# EAGLE schematic untitled (EAGLE 9.1.0)
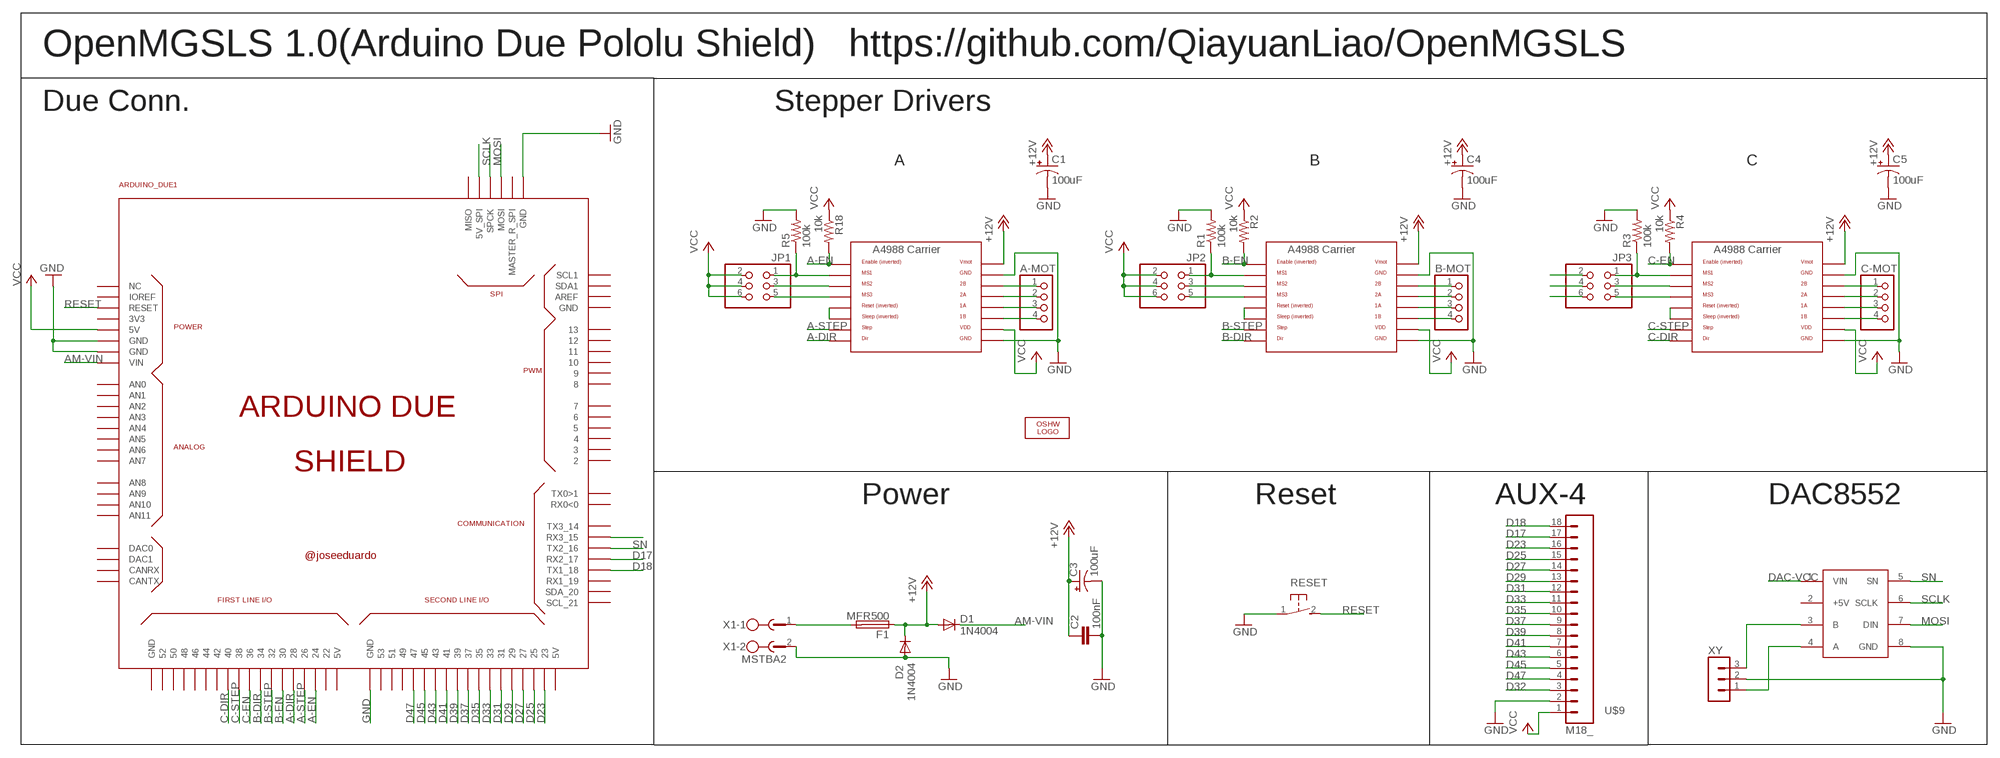
[diagram p0: schematic, sheet 1]

## Parts
A-MOT  PINHD-1X4  [1X04]
ARDUINO_DUE1  ARDUINO_DUE_SHIELD  [ARDUINO_DUE_SHIELD]
B-MOT  PINHD-1X4  [1X04]
C1  100uF  CPOL-US153CLV-0605  [153CLV-0605]
C2  100nF  C-EUC0805  [C0805]
C3  100uF  CPOL-US153CLV-0605  [153CLV-0605]
C4  100uF  CPOL-US153CLV-0605  [153CLV-0605]
C5  100uF  CPOL-US153CLV-0605  [153CLV-0605]
C-MOT  PINHD-1X4  [1X04]
D1  1N4004  [DO41-10]
D2  1N4004  [DO41-10]
F1  MFR500  PTCFUSE  [MFR500]
JP1  PINHD-2X3  [2X03]
JP2  PINHD-2X3  [2X03]
JP3  PINHD-2X3  [2X03]
LOGO1  OSHW_LOGO_6MILX0200-NT  [OSHW_6X200_NOTEXT]
R1  100k  R-US_R0805  [R0805]
R2  10k  R-US_R0805  [R0805]
R3  100k  R-US_R0805  [R0805]
R4  10k  R-US_R0805  [R0805]
R5  100k  R-US_R0805  [R0805]
R18  10k  R-US_R0805  [R0805]
RESET  31-XX  [B3F-31XX]
U$1  A4988BREAKOUT  [A4988BREAKOUT]
U$2  DAC8552  [DAC8552]
U$3  A4988BREAKOUT  [A4988BREAKOUT]
U$6  A4988BREAKOUT  [A4988BREAKOUT]
U$9  M18_  [1X18]
X1  MSTBA2  [MSTBA2]
XY  3PIN-HEADER  [3PIN-HEADER]

## Nets
+12V: C1.+ C2.1 C3.+ C4.+ C5.+ D1.A D2.C F1.1 U$1.VMOT U$3.VMOT U$6.VMOT
A-DIR: ARDUINO_DUE1.28 U$6.DIR
A-EN: ARDUINO_DUE1.24 R18.2 U$6.EN
A-STEP: ARDUINO_DUE1.26 U$6.STEP
AM-VIN: ARDUINO_DUE1.VIN D1.C
B-DIR: ARDUINO_DUE1.34 U$1.DIR
B-EN: ARDUINO_DUE1.30 R2.2 U$1.EN
B-STEP: ARDUINO_DUE1.32 U$1.STEP
C-DIR: ARDUINO_DUE1.40 U$3.DIR
C-EN: ARDUINO_DUE1.36 R4.2 U$3.EN
C-STEP: ARDUINO_DUE1.38 U$3.STEP
D17: ARDUINO_DUE1.17(RX2_17) U$9.17
D18: ARDUINO_DUE1.18(TX1_18) U$9.18
D23: ARDUINO_DUE1.23 U$9.16
D25: ARDUINO_DUE1.25 U$9.15
D27: ARDUINO_DUE1.27 U$9.14
D29: ARDUINO_DUE1.29 U$9.13
D31: ARDUINO_DUE1.31 U$9.12
D32: U$9.3
D33: ARDUINO_DUE1.33 U$9.11
D35: ARDUINO_DUE1.35 U$9.10
D37: ARDUINO_DUE1.37 U$9.9
D39: ARDUINO_DUE1.39 U$9.8
D41: ARDUINO_DUE1.41 U$9.7
D43: ARDUINO_DUE1.43 U$9.6
D45: ARDUINO_DUE1.45 U$9.5
D47: ARDUINO_DUE1.47 U$9.4
DAC-VCC: ARDUINO_DUE1.5V_2(5V_SPI) U$2.1(VIN)
GND: ARDUINO_DUE1.GND ARDUINO_DUE1.GND_1(GND) ARDUINO_DUE1.GND_3(GND) ARDUINO_DUE1.GND_5(GND) C1.- C2.2 C3.- C4.- C5.- D2.A R1.2 R3.2 R5.2 RESET.1(P) U$1.GND U$1.GND@0(GND) U$2.8(GND) U$3.GND U$3.GND@0(GND) U$6.GND U$6.GND@0(GND) U$9.2 X1.2 XY.2
MOSI: ARDUINO_DUE1.MOSI U$2.7(DIN)
N$1: U$6.RST U$6.SLP(SLEEP)
N$2: F1.2 X1.1
N$3: JP2.5 U$1.MS3
N$4: JP2.1 R1.1 U$1.MS1
N$5: JP2.3 U$1.MS2
N$6: B-MOT.1 U$1.2B
N$7: B-MOT.2 U$1.2A
N$8: B-MOT.3 U$1.1A
N$9: B-MOT.4 U$1.1B
N$10: U$1.RST U$1.SLP(SLEEP)
N$11: JP3.5 U$3.MS3
N$12: U$2.3(B) XY.3
N$13: U$2.4(A) XY.1
N$14: JP1.1 R5.1 U$6.MS1
N$15: JP1.3 U$6.MS2
N$16: JP3.1 R3.1 U$3.MS1
N$17: JP3.3 U$3.MS2
N$18: C-MOT.1 U$3.2B
N$19: JP1.5 U$6.MS3
N$20: C-MOT.2 U$3.2A
N$21: A-MOT.1 U$6.2B
N$22: A-MOT.2 U$6.2A
N$23: C-MOT.3 U$3.1A
N$24: C-MOT.4 U$3.1B
N$25: U$3.RST U$3.SLP(SLEEP)
N$26: A-MOT.3 U$6.1A
N$27: A-MOT.4 U$6.1B
RESET: ARDUINO_DUE1.RESET RESET.2(S)
SCLK: ARDUINO_DUE1.SPCK U$2.6(SCLK)
SN: ARDUINO_DUE1.16(TX2_16) U$2.5(SN)
VCC: ARDUINO_DUE1.5V0(5V) JP1.2 JP1.4 JP1.6 JP2.2 JP2.4 JP2.6 JP3.2 JP3.4 JP3.6 R2.1 R4.1 R18.1 U$1.VDD U$3.VDD U$6.VDD U$9.1
Z-MIN: ARDUINO_DUE1.15(RX3_15)
Unconnected: ARDUINO_DUE1.0(RX0<0) ARDUINO_DUE1.1(TX0>1) ARDUINO_DUE1.2 ARDUINO_DUE1.3 ARDUINO_DUE1.3V3 ARDUINO_DUE1.4 ARDUINO_DUE1.5 ARDUINO_DUE1.5V0_1(5V) ARDUINO_DUE1.5V0_2(5V) ARDUINO_DUE1.6 ARDUINO_DUE1.7 ARDUINO_DUE1.8 ARDUINO_DUE1.9 ARDUINO_DUE1.10 ARDUINO_DUE1.11 ARDUINO_DUE1.12 ARDUINO_DUE1.13 ARDUINO_DUE1.14(TX3_14) ARDUINO_DUE1.19(RX1_19) ARDUINO_DUE1.20(SDA_20) ARDUINO_DUE1.21(SCL_21) ARDUINO_DUE1.22 ARDUINO_DUE1.42 ARDUINO_DUE1.44 ARDUINO_DUE1.46 ARDUINO_DUE1.48 ARDUINO_DUE1.49 ARDUINO_DUE1.50 ARDUINO_DUE1.51 ARDUINO_DUE1.52 ARDUINO_DUE1.53 ARDUINO_DUE1.A0(AN0) ARDUINO_DUE1.A1(AN1) ARDUINO_DUE1.A2(AN2) ARDUINO_DUE1.A3(AN3) ARDUINO_DUE1.A4(AN4) ARDUINO_DUE1.A5(AN5) ARDUINO_DUE1.A6(AN6) ARDUINO_DUE1.A7(AN7) ARDUINO_DUE1.A8(AN8) ARDUINO_DUE1.A9(AN9) ARDUINO_DUE1.A10(AN10) ARDUINO_DUE1.A11(AN11) ARDUINO_DUE1.AREF ARDUINO_DUE1.CANRX ARDUINO_DUE1.CANTX ARDUINO_DUE1.DAC0 ARDUINO_DUE1.DAC1 ARDUINO_DUE1.GND_2(GND) ARDUINO_DUE1.GND_4(GND) ARDUINO_DUE1.IOREF ARDUINO_DUE1.MASTER_RESET_SPI(MASTER_R_SPI) ARDUINO_DUE1.MISO ARDUINO_DUE1.NC_2(NC) ARDUINO_DUE1.SCL1 ARDUINO_DUE1.SDA1 U$2.2(+5V)

## Notes on the sheet
- OpenMGSLS 1.0(Arduino Due Pololu Shield)   https://github.com/QiayuanLiao/OpenMGSLS
- Due Conn. | Stepper Drivers
- A | B | C
- Power | Reset | AUX-4 | DAC8552

## Library data of the parts
A-MOT B-MOT C-MOT = RepRapjr:PINHD-1X4: PIN HEADER
ARDUINO_DUE1 = RepRapjr:ARDUINO_DUE_SHIELD
C1 C3-C5 = adafruit:CPOL-US: POLARIZED CAPACITOR, American symbol
C2 = resistor:C-EU: CAPACITOR, European symbol
D1 D2 = diode:1N4004: DIODE general purpose rectifier, 1 A
F1 = RepRapjr:PTCFUSE: LITTLEFUSE Picofuse/slow Littlefuse
JP1-JP3 = pinhead:PINHD-2X3: PIN HEADER
LOGO1 = OSHW:OSHW_LOGO_6MIL
R1-R5 R18 = adafruit:R-US_: RESISTOR, American symbol
RESET = switch-omron:31-XX: OMRON SWITCH; MPN: B3F-3100; OC_FARNELL: 959704; OC_NEWARK: 36M3582
U$1 U$3 U$6 = RepRapjr:A4988BREAKOUT
U$2 = RepRapjr:DAC8552
U$9 = SparkFun:M18
X1 = con-phoenix-508:MSTBA2: PHOENIX; MF: FARNELL; MPN: 1757242; OC_FARNELL: 3705171; OC_NEWARK: 71C4161
XY = ultimachine:3PIN-HEADER: PIN HEADER